# Altium project MicroDial_Data_Log_V2.PrjPCB
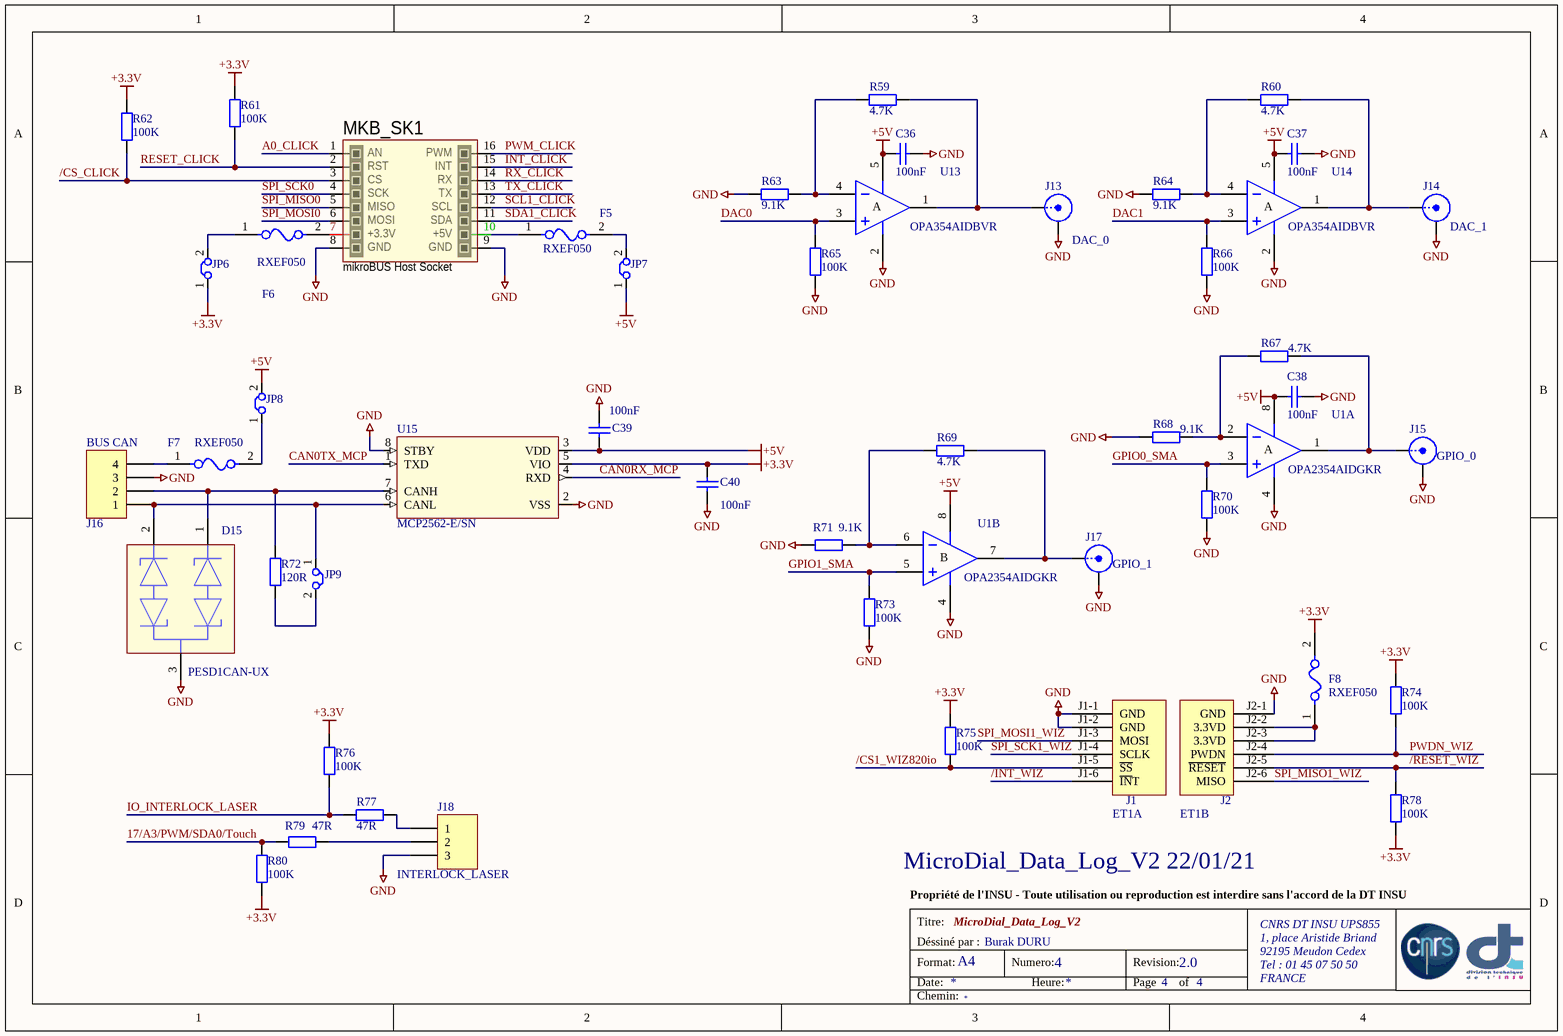
[diagram p0: MicroDial_Data_Log_V2_Part4.SchDoc]
4 sheets, 207 parts. Net scope: global (net labels, ports and power ports of the same name join across sheets).
Board file: MicroDial_Data_Log_V2.PcbDoc
Sheets:
  MicroDial_Data_Log_V2_Part4.SchDoc
  MicroDial_Data_Log_V2_Part2.SchDoc
  MicroDial_Data_Log_V2_Part3.SchDoc
  MicroDial_Data_Log_V2.SchDoc

## Sheet MicroDial_Data_Log_V2_Part4.SchDoc: MicroDial_Data_Log_V2
size A4; Author: Burak DURU; Organization: CNRS DT INSU UPS855; Address1: 1, place Aristide Briand; Address2: 92195 Meudon Cedex; Address3: Tel : 01 45 07 50 50; Address4: FRANCE; DocumentNumber: 4; Revision: 2.0; SheetNumber: 4; SheetTotal: 4

### Parts
C36  value 100nF  [C603]  (hidden comment: Capacitor CMS)
C37  value 100nF  [C603]  (hidden comment: Capacitor CMS)
C38  value 100nF  [C603]  (hidden comment: Capacitor CMS)
C39  value 100nF  [C603]  (hidden comment: Capacitor CMS)
C40  value 100nF  [C603]  (hidden comment: Capacitor CMS)
D15  PESD1CAN-UX  [SOT323 (SC70) - PESD1CAN-UX]
ET1  Module ETHERNET WIZNET WIZ820IO  [WIZ820io-V1.0]  (value not drawn)  (parts A,B of 2)
F5  RXEF050  [FP-RXEF050-MFG]
F6  RXEF050  [FP-RXEF050-MFG]
F7  RXEF050  [FP-RXEF050-MFG]
F8  RXEF050  [FP-RXEF050-MFG]
J13  DAC_0  [SMB125B1]
J14  DAC_1  [SMB125B1]
J15  GPIO_0  [SMA R125.680.000]
J16  BUS CAN  [PHOENIX CONTACT MC 1,5/ 4-G-3,81 - 1803293]
J17  GPIO_1  [SMA R125.680.000]
J18  INTERLOCK_LASER  [Molex 90136-2203 - UPDATE]
JP6  Cavalier 1 Positions 1-2  [Molex 90120-0762]  (value not drawn)
JP7  Cavalier 1 Positions 1-2  [Molex 90120-0762]  (value not drawn)
JP8  Cavalier 1 Positions 1-2  [Molex 90120-0762]  (value not drawn)
JP9  Cavalier 1 Positions 1-2  [Molex 90120-0762]  (value not drawn)
MKB_SK1  mikroBUS Host Socket  [mikroBUS Host Socket]
R59  value 4.7K  [MMA204]  (hidden comment: Res)
R60  value 4.7K  [MMA204]  (hidden comment: Res)
R61  value 100K  [R603]  (hidden comment: Res)
R62  value 100K  [R603]  (hidden comment: Res)
R63  value 9.1K  [MMA204]  (hidden comment: Res)
R64  value 9.1K  [MMA204]  (hidden comment: Res)
R65  value 100K  [R603]  (hidden comment: Res)
R66  value 100K  [R603]  (hidden comment: Res)
R67  value 4.7K  [MMA204]  (hidden comment: Res)
R68  value 9.1K  [MMA204]  (hidden comment: Res)
R69  value 4.7K  [MMA204]  (hidden comment: Res)
R70  value 100K  [R603]  (hidden comment: Res)
R71  value 9.1K  [MMA204]  (hidden comment: Res)
R72  value 120R  [R603]  (hidden comment: Res)
R73  value 100K  [R603]  (hidden comment: Res)
R74  value 100K  [R603]  (hidden comment: Res)
R75  value 100K  [R603]  (hidden comment: Res)
R76  value 100K  [R603]  (hidden comment: Res)
R77  value 47R  [R603]  (hidden comment: Res)
R78  value 100K  [R603]  (hidden comment: Res)
R79  value 47R  [R603]  (hidden comment: Res)
R80  value 100K  [R603]  (hidden comment: Res)
U1  OPA2354AIDGKR  [VSSOP-8 (DGK(S-PDSO-G8))]  (parts A,B of 2)
U13  OPA354AIDBVR  [SOT23-5]
U14  OPA354AIDBVR  [SOT23-5]
U15  MCP2562-E/SN  [SOIC8N (Narrow) - MCP2562-E]

### Nets
+3.3V: C40.1 F8.2 JP6.1 R61.2 R62.2 R74.2 R75.2 R76.2 R78.2 R80.1 U15.5(VIO)
+5V: C36.1 C37.1 C38.1 C39.1 JP7.1 JP8.2 U1.8(V+) U13.5(V+) U14.5(V+) U15.3(VDD)
GND: C36.2 C37.2 C38.2 C39.2 C40.2 D15.3(common_cathode) ET1.J1-1(GND) ET1.J1-2(GND) ET1.J2-1(GND) J13.2(Y) J14.2(Y) J15.2(Y) J16.3 J17.2(Y) J18.3 MKB_SK1.8(GND) MKB_SK1.9(GND) R63.1 R64.1 R65.1 R66.1 R68.1 R70.1 R71.1 R73.1 U1.4(V-) U13.2(V-) U14.2(V-) U15.2(VSS) U15.8(STBY)  [project net DIP2_1]
17/A3/PWM/SDA0/Touch: R79.1 R80.2
/CS1_WIZ820io: ET1.J1-5(~{SS}) R75.1
/CS_CLICK: MKB_SK1.3(CS) R62.1
/INT_WIZ: ET1.J1-6(~{IN}T)
/RESET_WIZ: ET1.J2-5(~{RESET}) R78.1
A0_CLICK: MKB_SK1.1(AN)
CAN0RX_MCP: U15.4(RXD)
CAN0TX_MCP: U15.1(TXD)
DAC0: R65.2 U13.3(IN+)
DAC1: R66.2 U14.3(IN+)
GPIO0_SMA: R70.2 U1.3(IN+)
GPIO1_SMA: R73.2 U1.5(IN+)
INT_CLICK: MKB_SK1.15(INT)
IO_INTERLOCK_LASER: R76.1 R77.1
PWDN_WIZ: ET1.J2-4(PWDN) R74.1
PWM_CLICK: MKB_SK1.16(PWM)
RESET_CLICK: MKB_SK1.2(RST) R61.1
RX_CLICK: MKB_SK1.14(RX)
SCL1_CLICK: MKB_SK1.12(SCL)
SDA1_CLICK: MKB_SK1.11(SDA)
SPI_MISO0: MKB_SK1.5(MISO)
SPI_MISO1_WIZ: ET1.J2-6(MISO)
SPI_MOSI0: MKB_SK1.6(MOSI)
SPI_MOSI1_WIZ: ET1.J1-3(MOSI)
SPI_SCK0: MKB_SK1.4(SCK)
SPI_SCK1_WIZ: ET1.J1-4(SCLK)
TX_CLICK: MKB_SK1.13(TX)
NetD15_1: D15.1(cathode_1) J16.2 R72.2 U15.7(CANH)
NetD15_2: D15.2(cathode_2) J16.1 JP9.1 U15.6(CANL)
NetET1_J2-2: ET1.J2-2(3.3VD) ET1.J2-3(3.3VD) F8.1
NetF5_1: F5.1 MKB_SK1.10(+5V)
NetF5_2: F5.2 JP7.2
NetF6_1: F6.1 JP6.2
NetF6_2: F6.2 MKB_SK1.7(+3.3V)
NetF7_1: F7.1 J16.4
NetF7_2: F7.2 JP8.1
NetJ13_1: J13.1(X) R59.2 U13.1(OUT)
NetJ14_1: J14.1(X) R60.2 U14.1(OUT)
NetJ15_1: J15.1(X) R67.2 U1.1(OUT)
NetJ17_1: J17.1(X) R69.2 U1.7(OUT)
NetJ18_1: J18.1 R77.2
NetJ18_2: J18.2 R79.2
NetJP9_2: JP9.2 R72.1
NetR59_1: R59.1 R63.2 U13.4(IN-)
NetR60_1: R60.1 R64.2 U14.4(IN-)
NetR67_1: R67.1 R68.2 U1.2(IN-)
NetR69_1: R69.1 R71.2 U1.6(IN-)

Not connected (* = marked no-connect by the designer): J13 3(REF) 4(REF) 5(REF); J14 3(REF) 4(REF) 5(REF); J15 3(REF) 4(REF) 5(REF); J17 3(REF) 4(REF) 5(REF)

### Notes on the sheet
- MicroDial_Data_Log_V2 22/01/21
- Propriété de l'INSU - Toute utilisation ou reproduction est interdire sans l'accord de la DT INSU
- Titre:
- Format:
- Date:
- Déssiné par :
- A4
- Numero:
- Heure:
- Revision:
- Page
- of
- Chemin:
- (in symbol OPA354AIDBVR) A
- (in symbol OPA2354AIDGKR, part A) A
- (in symbol OPA2354AIDGKR, part B) B
- (in symbol WIZ820IO, part A) J1
- (in symbol WIZ820IO, part B) J2

### Library data of the parts
C36-C40 = Cap: 06035C104JAT2A - Condensateur céramique multicouche CMS, 0603 [1608 Metric], 0.1 µF, 50 V, ± 5%, X7R; Code Commande: F174-0621
D15 = PESD1CAN-UX: Circuit de protection ESD, 50 V, SOT-323, 3 Broche(s), 150 W, PESD1 Series; Code Commande: F2357118; Value: PESD1CAN-UX
ET1 = WIZ820IO: IC MODULE W5200+MAG JACK Ethernet Contrôleur 10/100 Base-T/TX PHY SPI Interface Module WIZ820IO; Code Commande: Mouser 950-WIZ820IO + Digi-key  1278-1015-ND; Value: WIZNET WIZ820io
F5-F8 = RXEF050: RXEF050 -  Fusible PPTC réarmable, broches radiales, Série PolySwitch RXEF, 72 VDC, 500 mA, 1 A, 4 s, Rond; Code Commande: F117-5864; ComponentLink2Description: Datasheet; ComponentLink2URL: https://www.littelfuse.com/~/media/electronics/datasheets/resettable_ptcs/littelfuse_ptc_radial_leaded_rxef_datasheet.pdf.pdf; Value: RXEF050
J13 J14 = SMB1252B1-3GT30-50: Code Commande: F365-1241; Value: SMB1252B1-3GT30-50
J15 J17 = SMA RADIALL - R125680000: RADIALL - R125680000; Code Commande: F419-4810; Value: RADIALL - R125680000
J16 = PHOENIX CONTACT MC 1,5/ 4-G-3,81 - 1803293: Code Commande: F370-4749 / Digi-Key 277-1208-ND; Value: PHOENIX CONTACT MC 1,5/ 4-G-3,81 - 1803293
J18 = Molex 90136-2203: Molex 90136-2203 CGRID3 Simple Rangée Coudé 3V; Code Commande: RS670-5385; Value: Molex 90136-2203
JP6-JP9 = Jump 12: Jumper 2 Wire; Value: Molex 90120-0762; Code Commande: F973-3302
MKB_SK1 = mikroBUS Host Socket: mikroBUS Host Socket (Receptacle carte CLICK)
R59 R60 R67 R69 = Res: MMA02040E4701BB100 - Résistance CMS MELF, 4.7 kohm, Série MMA 0204, 200 V, Couche métallique, 250 mW, ± 0.1%; Code Commande: F308-6100
R61 R62 R65 R66 R70 R73-R76 R78 R80 = Res: CRGP0603F100K - Résistance à puce CMS, 100 kohm, ± 1%, 250 mW, 0603 [1608 Metric], Couche épaisse /; Code Commande: F286-1058
R63 R64 R68 R71 = Res: MMA02040E9101BB100 - Résistance CMS MELF, 9.1 kohm, Série MMA 0204, 200 V, Couche métallique, 250 mW, ± 0.1%; Code Commande: F308-6173
R72 = Res: CRGP0603F100K - Résistance à puce CMS, 100 kohm, ± 1%, 250 mW, 0603 [1608 Metric], Couche épaisse /; Code Commande: F348-2541
R77 R79 = Res: ERJ-UP3J470V - RES, 47R, 5%, 0.25W, 0603, THICK FILM; Code Commande: F348-2241
U1 = OPA2354AIDGKR: OPA2354AIDGKR Amplificateur opérationnel, Double, 2 amplificateurs, 350 kHz, 0.16 V/µs, 1.8V à 5.5V; Code Commande: F311-7463; Value: OPA2354AIDGKR
U13 U14 = OPA354AIDBVR: Amplificateur opérationnel, 1 amplificateur, 250 MHz, 150 V/µs, 2.5V à 5.5V, ± 1.25V à ± 2.75V; Code Commande: F311-7557 /Digikey 296-26279-1-ND; Value: OPA354AIDBVR
U15 = MCP2562-E/SN: MCP2562-E/SN Bus CAN, Émetteur-récepteur, CAN, LIN, 1, 1, 4.5 V, 5.5 V, SOIC; Code Commande: F236-2839; Value: MCP2562-E/SN

## Sheet MicroDial_Data_Log_V2_Part2.SchDoc: MicroDial_Data_Log_V2
size A4; Author: Burak DURU; Organization: CNRS DT INSU UPS855; Address1: 1, place Aristide Briand; Address2: 92195 Meudon Cedex; Address3: Tel : 01 45 07 50 50; Address4: FRANCE; DocumentNumber: 2; Revision: 2.0; SheetNumber: 2; SheetTotal: 4
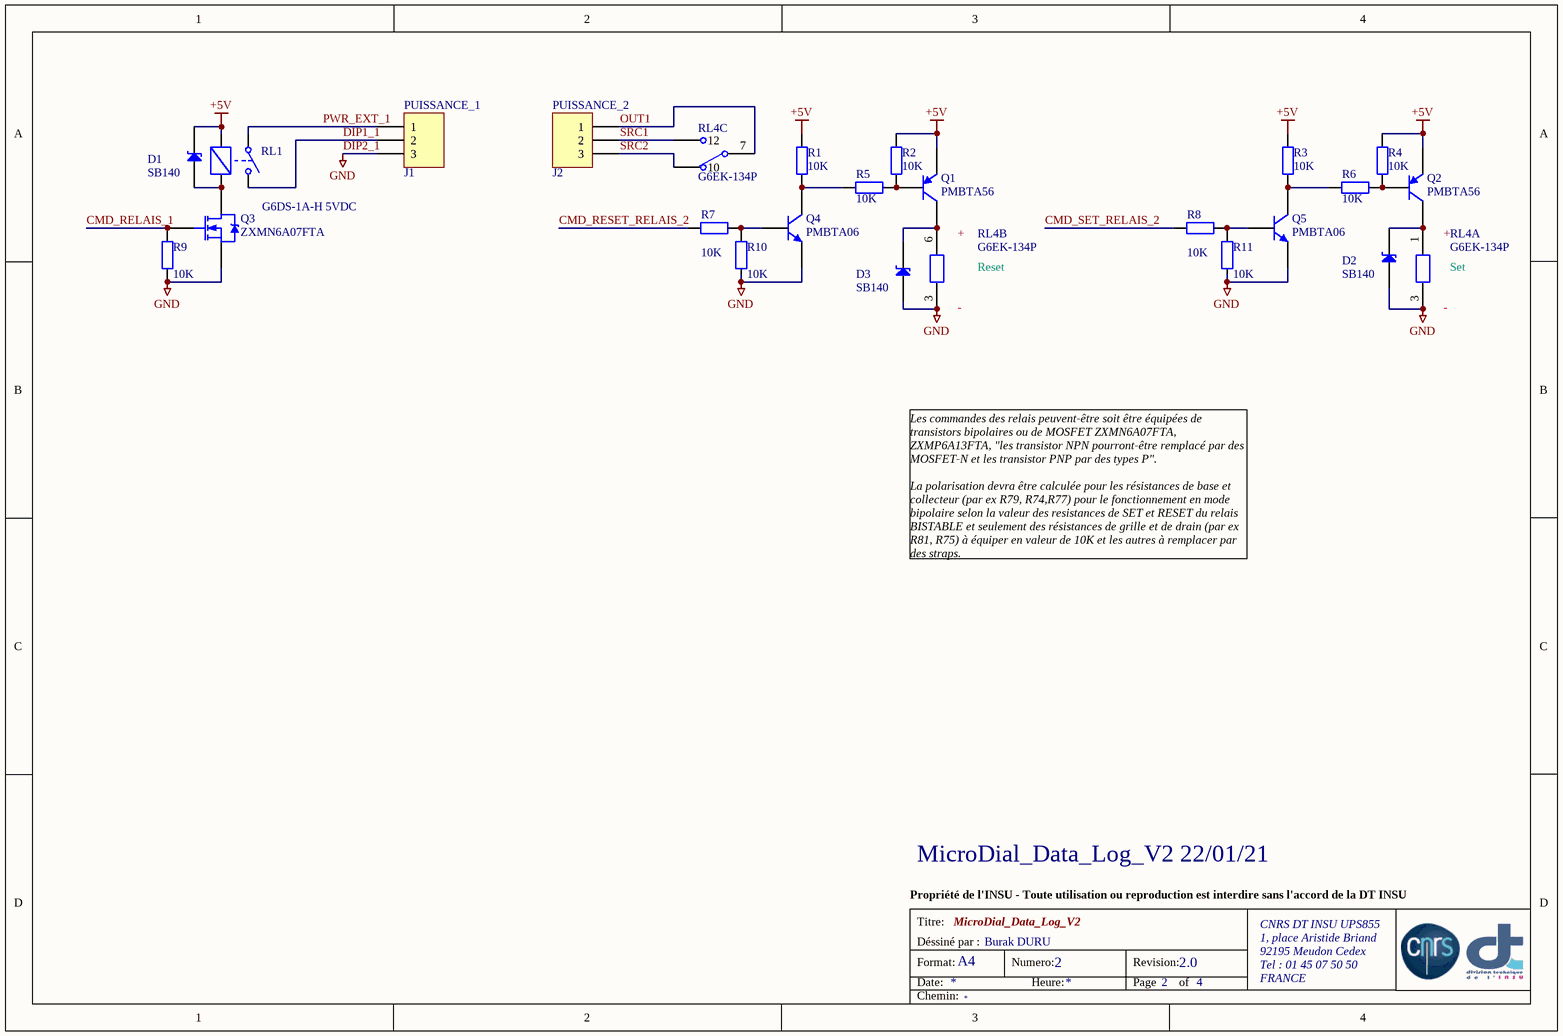
[diagram p1: MicroDial_Data_Log_V2_Part2.SchDoc]

### Parts
D1  SB140  [DO-41]
D2  SB140  [DO-41]
D3  SB140  [DO-41]
J1  PUISSANCE_1  [MKDS 1/3-3.81]
J2  PUISSANCE_2  [MKDS 1/3-3.81]
Q1  PMBTA56  [SOT-23A]
Q2  PMBTA56  [SOT-23A]
Q3  ZXMN6A07FTA  [SOT23 - NMOSFET]
Q4  PMBTA06  [SOT-23A]
Q5  PMBTA06  [SOT-23A]
R1  value 10K  [R603]  (hidden comment: Res)
R2  value 10K  [R603]  (hidden comment: Res)
R3  value 10K  [R603]  (hidden comment: Res)
R4  value 10K  [R603]  (hidden comment: Res)
R5  value 10K  [R603]  (hidden comment: Res)
R6  value 10K  [R603]  (hidden comment: Res)
R7  value 10K  [R603]  (hidden comment: Res)
R8  value 10K  [R603]  (hidden comment: Res)
R9  value 10K  [R603]  (hidden comment: Res)
R10  value 10K  [R603]  (hidden comment: Res)
R11  value 10K  [R603]  (hidden comment: Res)
RL1  G6DS-1A-H 5VDC  [G6DS-1A-H]
RL4  G6EK-134P  [G6EK-134P]  (parts A,B,C of 3)

### Nets
+5V: D1.2(K) Q1.2(E) Q2.2(E) R1.1 R2.1 R3.1 R4.1 RL1.16
DIP2_1: D2.1(A) D3.1(A) J1.3 Q3.3(S) Q4.2(E) Q5.2(E) R9.1 R10.1 R11.1 RL4.3  [also labelled GND]
CMD_RELAIS_1: Q3.1(G) R9.2
CMD_RESET_RELAIS_2: R7.2
CMD_SET_RELAIS_2: R8.2
DIP1_1: J1.2 RL1.6
OUT1: J2.1 RL4.7
PWR_EXT_1: J1.1 RL1.8
SRC1: J2.2 RL4.12
SRC2: J2.3 RL4.10
NetD1_1: D1.1(A) Q3.2(D) RL1.15
NetD2_2: D2.2(K) Q2.3(C) RL4.1
NetD3_2: D3.2(K) Q1.3(C) RL4.6
NetQ1_1: Q1.1(B) R2.2 R5.2
NetQ2_1: Q2.1(B) R4.2 R6.2
NetQ4_1: Q4.1(B) R7.1 R10.2
NetQ4_3: Q4.3(C) R1.2 R5.1
NetQ5_1: Q5.1(B) R8.1 R11.2
NetQ5_3: Q5.3(C) R3.2 R6.1

### Notes on the sheet
- Les commandes des relais peuvent-être soit être équipées de transistors bipolaires ou de MOSFET ZXMN6A07FTA, ZXMP6A13FTA, "les transistor NPN pourront-être remplacé par des MOSFET-N et les transistor PNP par des types P".
  La polarisation devra être calculée pour les résistances de base et collecteur (par ex R79, R74,R77) pour le fonctionnement en mode bipolaire selon la valeur des resistances de SET et RESET du relais BISTABLE et seulement des résistances de grille et de drain (par ex R81, R75) à équiper en valeur de 10K et les autres à remplacer par des straps.
- MicroDial_Data_Log_V2 22/01/21
- Propriété de l'INSU - Toute utilisation ou reproduction est interdire sans l'accord de la DT INSU
- Titre:
- Format:
- Date:
- Déssiné par :
- A4
- Numero:
- Heure:
- Revision:
- Page
- of
- Chemin:
- (in symbol G6EK-134P, part A) +; Set; -
- (in symbol G6EK-134P, part B) +; Reset; -

### Library data of the parts
D1-D3 = Diode_Schottky: SB140  Redresseur Schottky, 40 V, 1 A, Une, DO-41 (DO-204AL), 2 Broche(s), 500 mV; Code Commande: F146-7528; Value: SB140
J1 J2 = PHOENIX CONTACT MKDS 1/3-3.81: PHOENIX CONTACT MKDS 1/3-3.81  SR 3V DROIT; Value: PHOENIX CONTACT MKDS 1/ 3-3,81 - 1727023; Code Commande: F370-4580
Q1 Q2 = PMBTA56: PNP General Purpose Amplifier; Code Commande: Mouser 771-PMBTA56-T/R; Value: PMBTA56
Q3 = ZXMN6A07FTA: 60V N-Channel ENHANCEMENT MODE MOSFET; Code Commande: Mouser 522-ZXMN6A07FTA ou F952-5769; Value: ZXMN6A07FTA
Q4 Q5 = PMBTA06: NPN General Purpose Amplifier; Code Commande: MOUSER 771-PMBTA06-T/R; Value: PMBTA06
R1-R11 = Res: WF06P1002FTL Résistance à puce CMS, 10 kohm, ± 1%, 125 mW, 0603 [1608 Metric], Couche épaisse, Haute puissance; Code Commande: F250-2802
RL1 = G6DS-1A-H 5VDC: Relais 1RT Normalement Ouvert 5V 5A; Code Commande: RS613-2305; Value: G6D-1A-ASI 5VDC
RL4 = G6EK-134P: SPST RELAIS DOUBLE COIL; Value: G6EK-134P-ST-US-DC5; Code Commande: Mouser 653-G6EK-134P-DC5 / RS 683-9469

## Sheet MicroDial_Data_Log_V2_Part3.SchDoc: MicroDial_Data_Log_V2
size A4; Author: Burak DURU; Organization: CNRS DT INSU UPS855; Address1: 1, place Aristide Briand; Address2: 92195 Meudon Cedex; Address3: Tel : 01 45 07 50 50; Address4: FRANCE; DocumentNumber: 3; Revision: 2.0; SheetNumber: 3; SheetTotal: 4
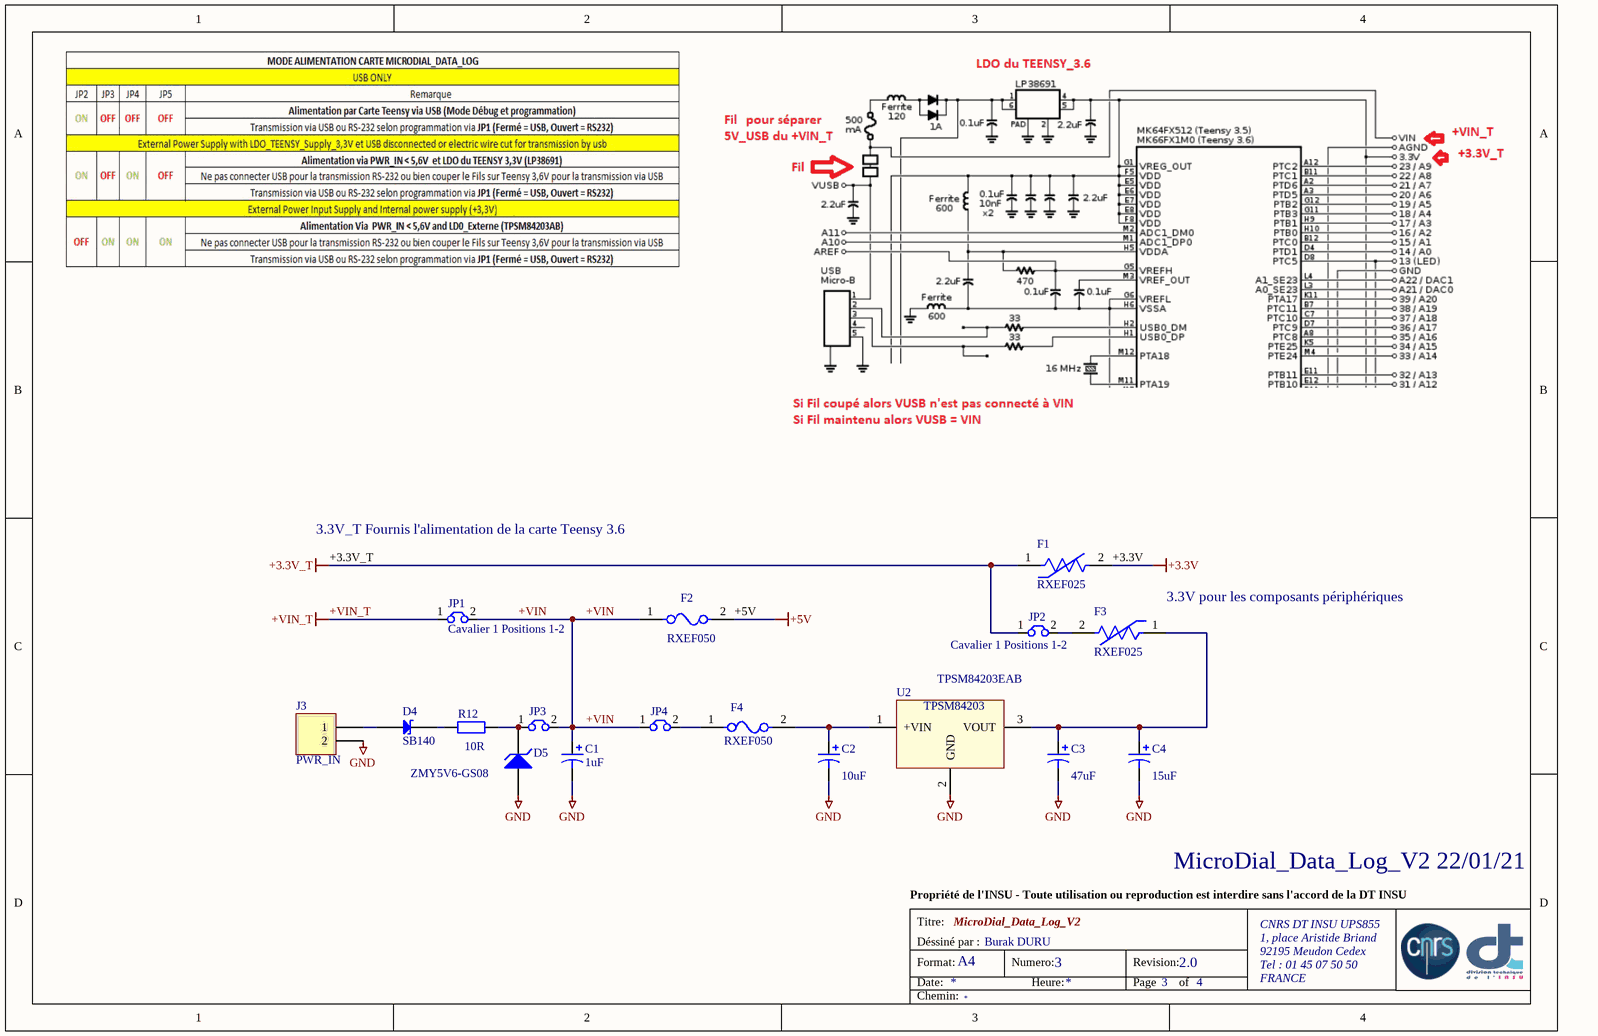
[diagram p2: MicroDial_Data_Log_V2_Part3.SchDoc]

### Parts
C1  value 1uF  [CAPPR5-10*x11.5]  (hidden comment: Condensateur Nichicon, 1μF, 450V c.c., série PS)
C2  value 10uF  [CAPA-B]  (hidden comment: Polarized Capacitor Tantale)
C3  value 47uF  [CAPA-B]  (hidden comment: Polarized Capacitor Tantale)
C4  value 15uF  [CAPA-D]  (hidden comment: Polarized Capacitor Tantale)
D4  SB140  [DO-41]
D5  ZMY5V6-GS08  [MELF DO-213AB]
F1  RXEF025  [FP-RXEF025-MFG]
F2  RXEF050  [FP-RXEF050-MFG]
F3  RXEF025  [FP-RXEF025-MFG]
F4  RXEF050  [FP-RXEF050-MFG]
J3  PWR_IN  [SL 3.5/2/90G]
JP1  Cavalier 1 Positions 1-2  [Molex 90120-0762]
JP2  Cavalier 1 Positions 1-2  [Molex 90120-0762]
JP3  Cavalier 1 Positions 1-2  [Molex 90120-0762]  (value not drawn)
JP4  Cavalier 1 Positions 1-2  [Molex 90120-0762]  (value not drawn)
R12  value 10R  [R1206]  (hidden comment: Res)
U2  TPSM84203EAB  [TPSM842XX SIPMODULE]

### Nets
+3.3V: F1.2
+3.3V_T: F1.1 JP2.1
+5V: F2.2
+VIN_T: JP1.1
GND: C1.2 C2.2 C3.2 C4.2 D5.1(A) J3.2 U2.2(GND)  [project net DIP2_1]
+VIN: C1.1 F2.1 JP1.2 JP3.2 JP4.1
NetC2_1: C2.1 F4.2 U2.1(+VIN)
NetC3_1: C3.1 C4.1 F3.1 U2.3(VOUT)
NetD4_1: D4.1(A) J3.1
NetD4_2: D4.2(K) R12.1
NetD5_2: D5.2(K) JP3.1 R12.2
NetF3_2: F3.2 JP2.2
NetF4_1: F4.1 JP4.2

### Notes on the sheet
- 3.3V_T Fournis l'alimentation de la carte Teensy 3.6
- (near F3) 3.3V pour les composants périphériques
- MicroDial_Data_Log_V2 22/01/21
- Propriété de l'INSU - Toute utilisation ou reproduction est interdire sans l'accord de la DT INSU
- Titre:
- Format:
- Date:
- Déssiné par :
- A4
- Numero:
- Heure:
- Revision:
- Page
- of
- Chemin:
- (in symbol TPSM84203EAB) TPSM84203

### Library data of the parts
C1 = Cap  Aluminuim Pol: Code Commande: RS851-5339
C2 = Cap Tantale Pol: 293D106X9025B2TE3 -  Condensateur tantale CMS, TANTAMOUNT®, 10 µF, 25 V, 1411 [3528 Metric], Série 293D, ± 10%, -55 °C; Code Commande: F235-3056
C3 = Cap Tantale Pol: T491B476K010AT -  Condensateur tantale CMS, 47 µF, 10 V, 1411 [3528 Metric], Série T491, ± 10%, -55 °C; Code Commande: F145-7458
C4 = Cap Tantale Pol: T491D156K035AT / Condensateur tantale CMS, 15 µF, 35 V, 2917 [7343 Metric], Série T491, ± 10%, -55 °C; Code Commande: F145-7496
D4 = Diode_Schottky: SB140 Redresseur Schottky, 40 V, 1 A, Une, DO-41 (DO-204AL), 2 Broche(s), 500 mV; Code Commande: F146-7528; Value: SB140
D5 = ZMY5V6-GS08: ZMY5V6-GS08 Diode simple Zener, AEC-Q101, 5.6 V, 1 W, MELF, 2 Broche(s), 175 °C /; Code Commande: F161-7742; Value: ZMY5V6-GS08
F1 F3 = RXEF025: RXEF025 -  FUSE, PTC RESET, 72V, 250mA, RADIAL; Code Commande: F266-8022; ComponentLink2URL: https://www.littelfuse.com/~/media/electronics/datasheets/resettable_ptcs/littelfuse_ptc_radial_leaded_rxef_datasheet.pdf.pdf; ComponentLink2Description: Datasheet; Value: RXEF025
F2 F4 = RXEF050: as F5 on sheet MicroDial_Data_Log_V2_Part4; ComponentLink2Description: Datasheet; ComponentLink2URL: https://www.littelfuse.com/~/media/electronics/datasheets/resettable_ptcs/littelfuse_ptc_radial_leaded_rxef_datasheet.pdf.pdf; Value: RXEF050
J3 = WEIDMULLER SL 3.5/2/90G: WEIDMULLER SL 3.5/2/90B SR 2V COUDE; Code Commande: RS171-578; Value: WEIDMULLER SL 3.5/2/90G
JP1-JP4 = Jump 12: as JP6 on sheet MicroDial_Data_Log_V2_Part4
R12 = Res: CRM1206-FX-10R0ELF -  Résistance à puce CMS, 10 ohm, ± 1%, 500 mW, 1206 [3216 Metric], Couche épaisse, Haute puissance,± 100ppm/°C; Code Commande: F186-5248
U2 = TPSM84203EAB: TPSM84203EAB -  Convertisseur DC/DC, 1 sortie, 4.95 W, 3.3 V, 1.5 A, TPSM842xx Family; Code Commande: F300-9711 / Mouser 595-TPSM84203EAB; Value: TPSM84203EAB -  Convertisseur DC/DC, 1 sortie, 4.95 W, 3.3 V, 1.5 A, TPSM842xx Family

## Sheet MicroDial_Data_Log_V2.SchDoc: MicroDial_Data_Log_V2
size A3; Author: Burak DURU; Organization: DT INSU CNRS; Address1: 1, place Aristide Briand; Address2: 92195 Meudon Cedex; Address3: Tel: 01 45 07 50 50; Address4: FRANCE; DocumentNumber: 1; Revision: 2.0; SheetNumber: 1; SheetTotal: 4
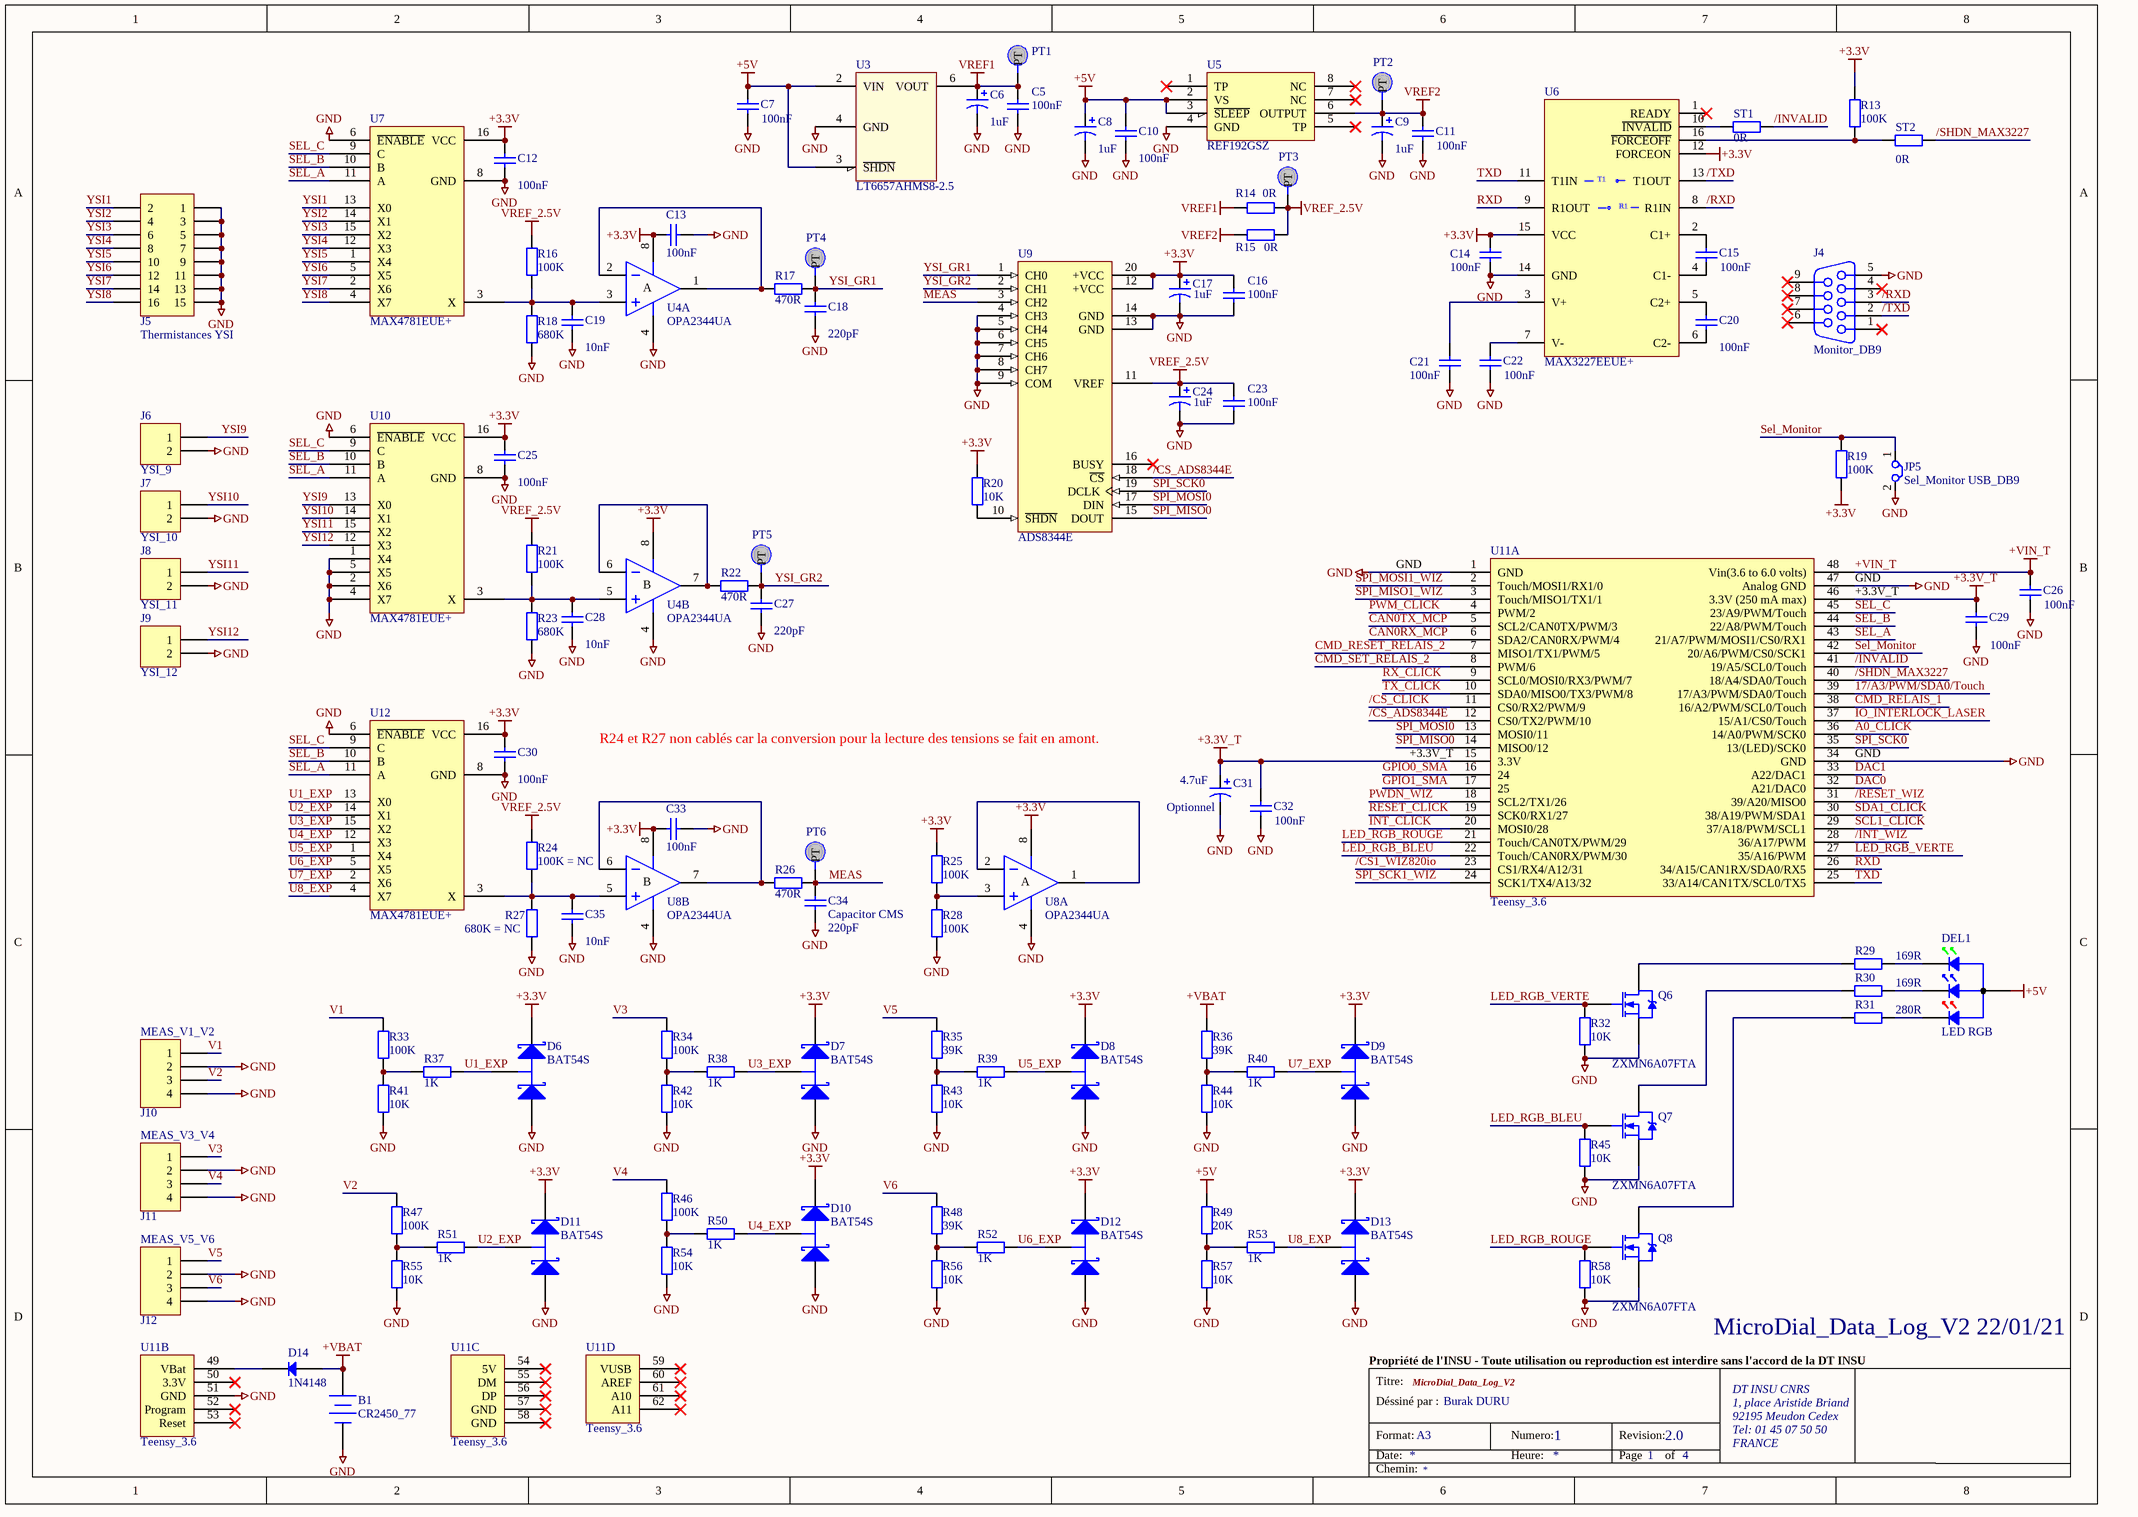
[diagram p3: MicroDial_Data_Log_V2.SchDoc]

### Parts
B1  CR2450_77  [Keystone-PN1025-7]
C5  value 100nF  [C603]  (hidden comment: Capacitor CMS)
C6  value 1uF  [CAPA-B]  (hidden comment: Polarized Capacitor Tantale)
C7  value 100nF  [C603]  (hidden comment: Capacitor CMS)
C8  value 1uF  [CAPA-B]  (hidden comment: Polarized Capacitor Tantale)
C9  value 1uF  [CAPA-B]  (hidden comment: Polarized Capacitor Tantale)
C10  value 100nF  [C603]  (hidden comment: Capacitor CMS)
C11  value 100nF  [C603]  (hidden comment: Capacitor CMS)
C12  value 100nF  [C603]  (hidden comment: Capacitor CMS)
C13  value 100nF  [C603]  (hidden comment: Capacitor CMS)
C14  value 100nF  [C603]  (hidden comment: Capacitor CMS)
C15  value 100nF  [C603]  (hidden comment: Capacitor CMS)
C16  value 100nF  [C603]  (hidden comment: Capacitor CMS)
C17  value 1uF  [CAPA-B]  (hidden comment: Polarized Capacitor Tantale)
C18  value 220pF  [C805]  (hidden comment: Capacitor CMS)
C19  value 10nF  [C603]  (hidden comment: Capacitor CMS)
C20  value 100nF  [C603]  (hidden comment: Capacitor CMS)
C21  value 100nF  [C603]  (hidden comment: Capacitor CMS)
C22  value 100nF  [C603]  (hidden comment: Capacitor CMS)
C23  value 100nF  [C603]  (hidden comment: Capacitor CMS)
C24  value 1uF  [CAPA-B]  (hidden comment: Polarized Capacitor Tantale)
C25  value 100nF  [C603]  (hidden comment: Capacitor CMS)
C26  value 100nF  [C603]  (hidden comment: Capacitor CMS)
C27  value 220pF  [C805]  (hidden comment: Capacitor CMS)
C28  value 10nF  [C603]  (hidden comment: Capacitor CMS)
C29  value 100nF  [C603]  (hidden comment: Capacitor CMS)
C30  value 100nF  [C603]  (hidden comment: Capacitor CMS)
C31  value 4.7uF  [CAPA-B]  (hidden comment: Polarized Capacitor Tantale)
C32  value 100nF  [C603]  (hidden comment: Capacitor CMS)
C33  value 100nF  [C603]  (hidden comment: Capacitor CMS)
C34  Capacitor CMS  value 220pF  [C805]
C35  value 10nF  [C603]  (hidden comment: Capacitor CMS)
D6  BAT54S  [SOT23 - SCHOTTKY]
D7  BAT54S  [SOT23 - SCHOTTKY]
D8  BAT54S  [SOT23 - SCHOTTKY]
D9  BAT54S  [SOT23 - SCHOTTKY]
D10  BAT54S  [SOT23 - SCHOTTKY]
D11  BAT54S  [SOT23 - SCHOTTKY]
D12  BAT54S  [SOT23 - SCHOTTKY]
D13  BAT54S  [SOT23 - SCHOTTKY]
D14  1N4148  [DO-35]
DEL1  LED RGB  [Kingbright WP154A4SEJ3VBDZGW/CA]
J4  Monitor_DB9  [CONEC 164A11519X]
J5  Thermistances YSI  [Molex 90130-3216]
J6  YSI_9  [Molex 90136-2202 - UPDATE]
J7  YSI_10  [Molex 90136-2202 - UPDATE]
J8  YSI_11  [Molex 90136-2202 - UPDATE]
J9  YSI_12  [Molex 90136-2202 - UPDATE]
J10  MEAS_V1_V2  [MKDS 1/4-3.81]
J11  MEAS_V3_V4  [MKDS 1/4-3.81]
J12  MEAS_V5_V6  [MKDS 1/4-3.81]
JP5  Sel_Monitor USB_DB9  [Molex 90120-0762]
PT1  Point Test  [PT]  (value not drawn)
PT2  Point Test  [PT]  (value not drawn)
PT3  Point Test  [PT]  (value not drawn)
PT4  Point Test  [PT]  (value not drawn)
PT5  Point Test  [PT]  (value not drawn)
PT6  Point Test  [PT]  (value not drawn)
Q6  ZXMN6A07FTA  [SOT23 - NMOSFET]
Q7  ZXMN6A07FTA  [SOT23 - NMOSFET]
Q8  ZXMN6A07FTA  [SOT23 - NMOSFET]
R13  value 100K  [R603]  (hidden comment: Res)
R14  value 0R  [R603]  (hidden comment: Res)
R15  value 0R  [R603]  (hidden comment: Res)
R16  value 100K  [MMA204]  (hidden comment: Res)
R17  value 470R  [R603]  (hidden comment: Res)
R18  value 680K  [MMA204]  (hidden comment: Res)
R19  value 100K  [R603]  (hidden comment: Res)
R20  value 10K  [R603]  (hidden comment: Res)
R21  value 100K  [MMA204]  (hidden comment: Res)
R22  value 470R  [R603]  (hidden comment: Res)
R23  value 680K  [MMA204]  (hidden comment: Res)
R24  value 100K = NC  [MMA204]  (hidden comment: Res)
R25  value 100K  [R603]  (hidden comment: Res)
R26  value 470R  [R603]  (hidden comment: Res)
R27  value 680K = NC  [MMA204]  (hidden comment: Res)
R28  value 100K  [R603]  (hidden comment: Res)
R29  value 169R  [R603]  (hidden comment: Res)
R30  value 169R  [R603]  (hidden comment: Res)
R31  value 280R  [R603]  (hidden comment: Res)
R32  value 10K  [R603]  (hidden comment: Res)
R33  value 100K  [MMA204]  (hidden comment: Res)
R34  value 100K  [MMA204]  (hidden comment: Res)
R35  value 39K  [MMA204]  (hidden comment: Res)
R36  value 39K  [MMA204]  (hidden comment: Res)
R37  value 1K  [R603]  (hidden comment: Res)
R38  value 1K  [R603]  (hidden comment: Res)
R39  value 1K  [R603]  (hidden comment: Res)
R40  value 1K  [R603]  (hidden comment: Res)
R41  value 10K  [MMA204]  (hidden comment: Res)
R42  value 10K  [MMA204]  (hidden comment: Res)
R43  value 10K  [MMA204]  (hidden comment: Res)
R44  value 10K  [MMA204]  (hidden comment: Res)
R45  value 10K  [R603]  (hidden comment: Res)
R46  value 100K  [MMA204]  (hidden comment: Res)
R47  value 100K  [MMA204]  (hidden comment: Res)
R48  value 39K  [MMA204]  (hidden comment: Res)
R49  value 20K  [MMA204]  (hidden comment: Res)
R50  value 1K  [R603]  (hidden comment: Res)
R51  value 1K  [R603]  (hidden comment: Res)
R52  value 1K  [R603]  (hidden comment: Res)
R53  value 1K  [R603]  (hidden comment: Res)
R54  value 10K  [MMA204]  (hidden comment: Res)
R55  value 10K  [MMA204]  (hidden comment: Res)
R56  value 10K  [MMA204]  (hidden comment: Res)
R57  value 10K  [MMA204]  (hidden comment: Res)
R58  value 10K  [R603]  (hidden comment: Res)
ST1  value 0R  [R603]  (hidden comment: Res)
ST2  value 0R  [R603]  (hidden comment: Res)
U3  LT6657AHMS8-2.5  [MSOP-8]
U4  OPA2344UA  [SOIC8N]  (parts A,B of 2)
U5  REF192GSZ  [SOIC8N]
U6  MAX3227EEUE+  [TSSOP-16 (U16-2)]
U7  MAX4781EUE+  [TSSOP-16]
U8  OPA2344UA  [SOIC8N]  (parts A,B of 2)
U9  ADS8344E  [QSOP20]
U10  MAX4781EUE+  [TSSOP-16]
U11  Teensy_3.6  [Teensy3_6]  (parts A,B,C,D of 4)
U12  MAX4781EUE+  [TSSOP-16]

### Nets
+3.3V: C12.1 C13.1 C14.1 C16.1 C17.1 C25.1 C30.1 C33.1 D6.2(K) D7.2(K) D8.2(K) D9.2(K) D10.2(K) D11.2(K) D12.2(K) D13.2(K) R13.1 R19.1 R20.2 R25.2 U4.8(V+) U6.12(FORCEON) U6.15(VCC) U7.16(VCC) U8.8(V+) U9.12(+VCC) U9.20(+VCC) U10.16(VCC) U12.16(VCC)
+3.3V_T: C29.1 C31.1 C32.1 U11.15(3.3V) U11.46(3.3V_(250_mA_max))
+5V: C7.1 C8.1 C10.1 DEL1.2(A_RGB) R49.2 U3.2(VIN) U3.3(~{SHDN}) U5.2(VS) U5.3(~{SLEEP})
+VBAT: B1.1(+) D14.1(A) R36.2
+VIN_T: C26.1 U11.48(Vin(3.6_to_6.0_volts))
GND: B1.2(-) C5.2 C6.2 C7.2 C8.2 C9.2 C10.2 C11.2 C12.2 C13.2 C14.2 C16.2 C17.2 C18.2 C19.2 C21.2 C22.2 C23.2 C24.2 C25.2 C26.2 C27.2 C28.2 C29.2 C30.2 C31.2 C32.2 C33.2 C34.2 C35.2 D6.3(A) D7.3(A) D8.3(A) D9.3(A) D10.3(A) D11.3(A) D12.3(A) D13.3(A) J4.5 J5.1 J5.3 J5.5 J5.7 J5.9 J5.11 J5.13 J5.15 J6.2 J7.2 J8.2 J9.2 J10.2 J10.4 J11.2 J11.4 J12.2 J12.4 JP5.2 Q6.3(S) Q7.3(S) Q8.3(S) R18.1 R23.1 R27.1 R28.1 R32.1 R41.1 R42.1 R43.1 R44.1 R45.1 R54.2 R55.1 R56.1 R57.1 R58.1 U3.4(GND) U4.4(V-) U5.4(GND) U6.14(GND) U7.6(~{ENABLE}) U7.8(GND) U8.4(V-) U9.4(CH3) U9.5(CH4) U9.6(CH5) U9.7(CH6) U9.8(CH7) U9.9(COM) U9.13(GND) U9.14(GND) U10.1(X4) U10.2(X6) U10.4(X7) U10.5(X5) U10.6(~{ENABLE}) U10.8(GND) U11.1(GND) U11.34(GND) U11.47(Analog_GND) U11.51(GND) U12.6(~{ENABLE}) U12.8(GND)  [project net DIP2_1]
VREF1: C5.1 C6.1 PT1.1(PT) R14.1 U3.6(VOUT)
VREF2: C9.1 C11.1 PT2.1(PT) R15.1 U5.6(OUTPUT)
VREF_2.5V: C23.1 C24.1 PT3.1(PT) R14.2 R15.2 R16.2 R21.2 R24.2 U9.11(VREF)
17/A3/PWM/SDA0/Touch: U11.39(17/A3/PWM/SDA0/Touch)
/CS1_WIZ820io: U11.23(CS1/RX4/A12/31)
/CS_ADS8344E: U9.18(~{CS}) U11.12(CS0/TX2/PWM/10)
/CS_CLICK: U11.11(CS0/RX2/PWM/9)
/INT_WIZ: U11.28(36/A17/PWM)
/INVALID: ST1.1 U11.41(19/A5/SCL0/Touch)
/RESET_WIZ: U11.31(39/A20/MISO0)
/RXD: J4.3 U6.8(R1IN)
/SHDN_MAX3227: ST2.2 U11.40(18/A4/SDA0/Touch)
/TXD: J4.2 U6.13(T1OUT)
A0_CLICK: U11.36(14/A0/PWM/SCK0)
CAN0RX_MCP: U11.6(SDA2/CAN0RX/PWM/4)
CAN0TX_MCP: U11.5(SCL2/CAN0TX/PWM/3)
CMD_RELAIS_1: U11.38(16/A2/PWM/SCL0/Touch)
CMD_RESET_RELAIS_2: U11.7(MISO1/TX1/PWM/5)
CMD_SET_RELAIS_2: U11.8(PWM/6)
DAC0: U11.32(A21/DAC0)
DAC1: U11.33(A22/DAC1)
GPIO0_SMA: U11.16(24)
GPIO1_SMA: U11.17(25)
INT_CLICK: U11.20(MOSI0/28)
IO_INTERLOCK_LASER: U11.37(15/A1/CS0/Touch)
LED_RGB_BLEU: Q7.1(G) R45.2 U11.22(Touch/CAN0RX/PWM/30)
LED_RGB_ROUGE: Q8.1(G) R58.2 U11.21(Touch/CAN0TX/PWM/29)
LED_RGB_VERTE: Q6.1(G) R32.2 U11.27(35/A16/PWM)
MEAS: C34.1 PT6.1(PT) R26.1 U9.3(CH2)
PWDN_WIZ: U11.18(SCL2/TX1/26)
PWM_CLICK: U11.4(PWM/2)
RESET_CLICK: U11.19(SCK0/RX1/27)
RX_CLICK: U11.9(SCL0/MOSI0/RX3/PWM/7)
RXD: U6.9(R1OUT) U11.26(34/A15/CAN1RX/SDA0/RX5)
SCL1_CLICK: U11.29(37/A18/PWM/SCL1)
SDA1_CLICK: U11.30(38/A19/PWM/SDA1)
SEL_A: U7.11(A) U10.11(A) U11.43(21/A7/PWM/MOSI1/CS0/RX1) U12.11(A)
SEL_B: U7.10(B) U10.10(B) U11.44(22/A8/PWM/Touch) U12.10(B)
SEL_C: U7.9(C) U10.9(C) U11.45(23/A9/PWM/Touch) U12.9(C)
Sel_Monitor: JP5.1 R19.2 U11.42(20/A6/PWM/CS0/SCK1)
SPI_MISO0: U9.15(DOUT) U11.14(MISO0/12)
SPI_MISO1_WIZ: U11.3(Touch/MISO1/TX1/1)
SPI_MOSI0: U9.17(DIN) U11.13(MOSI0/11)
SPI_MOSI1_WIZ: U11.2(Touch/MOSI1/RX1/0)
SPI_SCK0: U9.19(DCLK) U11.35(13/(LED)/SCK0)
SPI_SCK1_WIZ: U11.24(SCK1/TX4/A13/32)
TX_CLICK: U11.10(SDA0/MISO0/TX3/PWM/8)
TXD: U6.11(T1IN) U11.25(33/A14/CAN1TX/SCL0/TX5)
U1_EXP: D6.1(C) R37.1 U12.13(X0)
U2_EXP: D11.1(C) R51.1 U12.14(X1)
U3_EXP: D7.1(C) R38.1 U12.15(X2)
U4_EXP: D10.1(C) R50.2 U12.12(X3)
U5_EXP: D8.1(C) R39.1 U12.1(X4)
U6_EXP: D12.1(C) R52.1 U12.5(X5)
U7_EXP: D9.1(C) R40.1 U12.2(X6)
U8_EXP: D13.1(C) R53.1 U12.4(X7)
V1: J10.1 R33.2
V2: J10.3 R47.2
V3: J11.1 R34.2
V4: J11.3 R46.2
V5: J12.1 R35.2
V6: J12.3 R48.2
YSI1: J5.2 U7.13(X0)
YSI2: J5.4 U7.14(X1)
YSI3: J5.6 U7.15(X2)
YSI4: J5.8 U7.12(X3)
YSI5: J5.10 U7.1(X4)
YSI6: J5.12 U7.5(X5)
YSI7: J5.14 U7.2(X6)
YSI8: J5.16 U7.4(X7)
YSI9: J6.1 U10.13(X0)
YSI10: J7.1 U10.14(X1)
YSI11: J8.1 U10.15(X2)
YSI12: J9.1 U10.12(X3)
YSI_GR1: C18.1 PT4.1(PT) R17.1 U9.1(CH0)
YSI_GR2: C27.1 PT5.1(PT) R22.1 U9.2(CH1)
NetC15_1: C15.1 U6.2(C1+)
NetC15_2: C15.2 U6.4(C1-)
NetC19_1: C19.1 R16.1 R18.2 U4.3(IN+) U7.3(X)
NetC20_1: C20.1 U6.5(C2+)
NetC20_2: C20.2 U6.6(C2-)
NetC21_1: C21.1 U6.3(V+)
NetC22_1: C22.1 U6.7(V-)
NetC28_1: C28.1 R21.1 R23.2 U4.5(IN+) U10.3(X)
NetC35_1: C35.1 R24.1 R27.2 U8.5(IN+) U12.3(X)
NetD14_2: D14.2(K) U11.49(VBat)
NetDEL1_1: DEL1.1(K_Red) R31.2
NetDEL1_3: DEL1.3(K_Blue) R30.2
NetDEL1_4: DEL1.4(K_Green) R29.2
NetQ6_2: Q6.2(D) R29.1
NetQ7_2: Q7.2(D) R30.1
NetQ8_2: Q8.2(D) R31.1
NetR13_2: R13.2 ST2.1 U6.16(~{FORCEOFF})
NetR17_2: R17.2 U4.1(OUT) U4.2(IN-)
NetR20_1: R20.1 U9.10(~{SHDN})
NetR22_2: R22.2 U4.6(IN-) U4.7(OUT)
NetR25_1: R25.1 R28.2 U8.3(IN+)
NetR26_2: R26.2 U8.6(IN-) U8.7(OUT)
NetR33_1: R33.1 R37.2 R41.2
NetR34_1: R34.1 R38.2 R42.2
NetR35_1: R35.1 R39.2 R43.2
NetR36_1: R36.1 R40.2 R44.2
NetR46_1: R46.1 R50.1 R54.1
NetR47_1: R47.1 R51.2 R55.2
NetR48_1: R48.1 R52.2 R56.2
NetR49_1: R49.1 R53.2 R57.2
NetST1_2: ST1.2 U6.10(~{INVALID})
NetU8_1: U8.1(OUT) U8.2(IN-)

Not connected (* = marked no-connect by the designer): J4 1* 4* 6* 7* 8* 9*; U3 1(DNC) 5(DNC) 7(DNC) 8(DNC); U5 1(TP)* 5(TP)* 7(NC)* 8(NC)*; U6 1(READY)*; U9 16(BUSY)*; U11 50(3.3V)* 52(Program)* 53(Reset)* 54(5V)* 55(DM)* 56(DP)* 57(GND)* 58(GND)* 59(VUSB)* 60(AREF)* 61(A10)* 62(A11)*

### Notes on the sheet
- R24 et R27 non cablés car la conversion pour la lecture des tensions se fait en amont.
- (near C31) Optionnel
- MicroDial_Data_Log_V2 22/01/21
- Propriété de l'INSU - Toute utilisation ou reproduction est interdire sans l'accord de la DT INSU
- Titre:
- Format:
- Date:
- Déssiné par :
- A3
- Numero:
- Heure:
- Revision:
- Page
- of
- Chemin:
- (in symbol MAX3227EEUE+) T1; R1
- (in symbol OPA2344, part A) A
- (in symbol OPA2344, part B) B

### Library data of the parts
B1 = Battery_CR2450_77: Coin CELL; Value: KEYSTONE 1025-7 + CR2477 ou 2450; Code Commande: F165-0668 + F521-9632
C5 C7 C10-C16 C20-C23 C25 C26 C29 C30 C32 C33 = Cap: as C36 on sheet MicroDial_Data_Log_V2_Part4
C6 C8 C9 C17 C24 = Cap Tantale Pol: Polarized Capacitor Tantale Condensateur Tantale KEMET, 1μF, ±10%, 35 V,ESR 2Ω, CMS boitier B, série T494; Code Commande: RS538-2773 ou RS147-493
C18 C27 C34 = Cap: C0805C221K5RACTU - Condensateur céramique multicouche CMS, 0805 [2012 Metric], 220 pF, 50 V, ± 10%, X7R, Série C; Code Commande: F141-4680
C19 C28 C35 = Cap: 06035C103JAT2A - Condensateur céramique multicouche CMS, 0603 [1608 Metric], 0.01 µF, 50 V, ± 5%, X7R; Code Commande: F183-3871
C31 = Cap Tantale Pol: Polarized Capacitor Tantale TPSB475K035R0700 - Condensateur tantale CMS B, 4.7 µF, 35 V, Série TPS, ± 10%, 1210 [3225 Metric]; Code Commande: F165-8970
D6-D13 = BAT54S_News: Schottky Barrier Double Diode; Code Commande: F980-1510; Value: BAT54S
D14 = Diode: 1N4148 Diode signaux faibles, 100 V, 200 mA, 1 V, 4 ns, 4 A; Code Commande: F108-1177; Value: 1N4148
DEL1 = Kingbright WP154A4SEJ3VBDZGW/CA: Kingbright WP154A4SEJ3VBDZGW/CA T-1 3/4 (5mm) Full Color LED Lamp RGB; Code Commande: Mouser 604-WP154A43VBDZGWCA; Value: Kingbright WP154A4SEJ3VBDZGW/CA
J4 = CONEC 164A11519X: CI D-SUB9 FEMELLE 90°; Code Commande: Mouser 706-164A11519X /  DIGIKEY 164A11519X-ND; Value: CONEC 164A11519X
J5 = Molex 90130-3216: Molex 90130-3216 CGRID3 Double Rangée Coudé 16V; Code Commande: F973-4040; Value: Molex 90130-3216
J6-J9 = Molex 90136-2202: Molex 90136-2202 CGRID3 Simple Rangée Coudé 2V; Code Commande: RS 670-5376; Value: Molex 90136-2202
J10-J12 = PHOENIX CONTACT MKDS 1/4-3.81: PHOENIX CONTACT MKDS 1/4-3.81  SR 10V DROIT; Value: PHOENIX CONTACT MKDS 1/ 4-3,81 - 1727036; Code Commande: F370-4592
JP5 = Jump 12: as JP6 on sheet MicroDial_Data_Log_V2_Part4
PT1-PT6 = PT_1: Code Commande: F385-1564; Value: W HUGHES 300-3001
Q6-Q8 = ZXMN6A07FTA: as Q3 on sheet MicroDial_Data_Log_V2_Part2; Value: ZXMN6A07FTA
R13 R19 R25 R28 = Res: CRGP0603F100K Résistance à puce CMS, 100 kohm, ± 1%, 250 mW, 0603 [1608 Metric], Couche épaisse; Code Commande: F286-1058
R14 R15 ST1 ST2 = Res: MC0603WG00000T5E-TR -  Résistance à puce CMS, 0 ohm, 63 mW, 0603 [1608 Metric], Couche épaisse, Usage Général; Code Commande: F169-2453
R16 R21 R33 R34 R46 R47 = Res: MMA02040E1003BB100 - Résistance CMS MELF, 100 kohm, 200 V, 250 mW, ± 0.1%, Série MMA 0204, Couche métallique; Code Commande: F308-6422
R17 R22 R26 = Res: ERJPA3F4700V -  Résistance à puce CMS, Couche épaisse, 0603 [1608 Metric], 470 ohm, Série ERJPA3, 150 V; Code Commande: F233-5919
R18 R23 = Res: MMA0204MC6803FB300 -  Surface Mount MELF Resistor, 680 kohm, VISHAY - MMA 0204 HV Series, 500 V, Thin Film, 250 mW, ± 1%± 50ppm/K; Code Commande: F247-1794
R20 R32 R45 R58 = Res: as R1 on sheet MicroDial_Data_Log_V2_Part2
R24 = Res: MMA02040E1003BB100 - Résistance CMS MELF, 100 kohm, 200 V, 250 mW, ± 0.1%, Série MMA 0204, Couche métallique; Code Commande: F308-6422 = NC
R27 = Res: MMA0204MC6803FB300 -  Surface Mount MELF Resistor, 680 kohm, VISHAY - MMA 0204 HV Series, 500 V, Thin Film, 250 mW, ± 1%± 50ppm/K; Code Commande: F247-1794 = NC
R29 R30 = Res: ERJPA3F1690V Résistance à puce CMS, Anti-surtensions, 169 ohm, ± 1%, 250 mW, 0603 [1608 Metric], Couche épaisse; Code Commande: F256-1819
R31 = Res: ERJPA3F2800V Résistance à puce CMS, Anti-surtensions, 280 ohm, ± 1%, 250 mW, 0603 [1608 Metric], Couche épaisse; Code Commande: F256-1932
R35 R36 R48 = Res: MMA02040E3902BB100 -  Résistance CMS MELF, 39 kohm, Série MMA 0204, 200 V, Couche métallique, 250 mW, ± 0.1%; Code Commande: F308-6320
R37-R40 R50-R53 = Res: ASC0603-1K0FT5 -  Résistance à puce CMS, Couche épaisse, 1 kohm, ± 1%, 100 mW, 0603 [1608 Metric], Couche épaisse; Code Commande: F207-8907
R41-R44 R54-R57 = Res: MMA02040E1002BB100 - Résistance CMS MELF, 10 kohm, 200 V, 250 mW, ± 0.1%, Série MMA 0204, Couche métallique; Code Commande: F308-6185
R49 = Res: MMA02040C2002FB300 Résistance CMS MELF, 20 kohm, MMA 0204 Series, 200 V, Couche mince, 250 mW, ± 1%; Code Commande: F261-4478
U3 = LT6657: LT6657AHMS8-2.5#PBF Référence de tension Series, AEC-Q100, Référence 2.5V, 1.5ppm/°C, MSOP-8; Code Commande: Digikey LT6657AHMS8-2.5#PBF-ND; Value: LT6657AHMS8-2.5#PBF-ND
U4 U8 = OPA2344: OPA2344UA Amplificateur opérationnel, 2 amplificateurs, 1 MHz, 0.8 V/µs, 2.5V à 5.5V, SOIC, 8 Broche(s); Code Commande: F311-7453; Value: OPA2344UA
U5 = REF192: Precision Micropower, Low Dropout  Voltage References; Code Commande: F960-5207; Value: REF192GSZ
U6 = MAX3227EEUE+: MAX3227EEUE+ -  Transceiver, RS232, Alimentation 3V-5.5V, 1 Driver, TSSOP-16; Code Commande: F251-1501; Value: MAX3227EEUE+
U7 U10 U12 = MAX4781EUE+: MULTIPLEXEUR ANALOG SIMPLE 8:1; Code Commande: F251-3726; Value: MAX4781EUE+
U9 = ADS8344E: 16-Bit, 8-Channel Serial Output Sampling  ANALOG-TO-DIGITAL CONVERTER; Code Commande: F300-4391; Value: ADS8344E
U11 = Teensy_3.6: 32Bit Arduino Compatible Microcontrolleur; Code Commande: Digikey 1568-1465-ND / Mouser 474-DEV-14058; Value: Teensy_3.6

## Nets that join several sheets
+3.3V: MicroDial_Data_Log_V2_Part4 (11 pins), MicroDial_Data_Log_V2_Part3 (F1.2), MicroDial_Data_Log_V2 (29 pins)
+3.3V_T: MicroDial_Data_Log_V2_Part3 (F1.1 JP2.1), MicroDial_Data_Log_V2 (5 pins)
+5V: MicroDial_Data_Log_V2_Part4 (10 pins), MicroDial_Data_Log_V2_Part2 (8 pins), MicroDial_Data_Log_V2_Part3 (F2.2), MicroDial_Data_Log_V2 (9 pins)
+VIN_T: MicroDial_Data_Log_V2_Part3 (JP1.1), MicroDial_Data_Log_V2 (C26.1 U11.48)
DIP2_1: MicroDial_Data_Log_V2_Part4 (30 pins), MicroDial_Data_Log_V2_Part2 (10 pins), MicroDial_Data_Log_V2_Part3 (7 pins), MicroDial_Data_Log_V2 (103 pins)
17/A3/PWM/SDA0/Touch: MicroDial_Data_Log_V2_Part4 (R79.1 R80.2), MicroDial_Data_Log_V2 (U11.39)
/CS1_WIZ820io: MicroDial_Data_Log_V2_Part4 (ET1.J1-5 R75.1), MicroDial_Data_Log_V2 (U11.23)
/CS_CLICK: MicroDial_Data_Log_V2_Part4 (MKB_SK1.3 R62.1), MicroDial_Data_Log_V2 (U11.11)
/INT_WIZ: MicroDial_Data_Log_V2_Part4 (ET1.J1-6), MicroDial_Data_Log_V2 (U11.28)
/RESET_WIZ: MicroDial_Data_Log_V2_Part4 (ET1.J2-5 R78.1), MicroDial_Data_Log_V2 (U11.31)
A0_CLICK: MicroDial_Data_Log_V2_Part4 (MKB_SK1.1), MicroDial_Data_Log_V2 (U11.36)
CAN0RX_MCP: MicroDial_Data_Log_V2_Part4 (U15.4), MicroDial_Data_Log_V2 (U11.6)
CAN0TX_MCP: MicroDial_Data_Log_V2_Part4 (U15.1), MicroDial_Data_Log_V2 (U11.5)
CMD_RELAIS_1: MicroDial_Data_Log_V2_Part2 (Q3.1 R9.2), MicroDial_Data_Log_V2 (U11.38)
CMD_RESET_RELAIS_2: MicroDial_Data_Log_V2_Part2 (R7.2), MicroDial_Data_Log_V2 (U11.7)
CMD_SET_RELAIS_2: MicroDial_Data_Log_V2_Part2 (R8.2), MicroDial_Data_Log_V2 (U11.8)
DAC0: MicroDial_Data_Log_V2_Part4 (R65.2 U13.3), MicroDial_Data_Log_V2 (U11.32)
DAC1: MicroDial_Data_Log_V2_Part4 (R66.2 U14.3), MicroDial_Data_Log_V2 (U11.33)
GPIO0_SMA: MicroDial_Data_Log_V2_Part4 (R70.2 U1.3), MicroDial_Data_Log_V2 (U11.16)
GPIO1_SMA: MicroDial_Data_Log_V2_Part4 (R73.2 U1.5), MicroDial_Data_Log_V2 (U11.17)
INT_CLICK: MicroDial_Data_Log_V2_Part4 (MKB_SK1.15), MicroDial_Data_Log_V2 (U11.20)
IO_INTERLOCK_LASER: MicroDial_Data_Log_V2_Part4 (R76.1 R77.1), MicroDial_Data_Log_V2 (U11.37)
PWDN_WIZ: MicroDial_Data_Log_V2_Part4 (ET1.J2-4 R74.1), MicroDial_Data_Log_V2 (U11.18)
PWM_CLICK: MicroDial_Data_Log_V2_Part4 (MKB_SK1.16), MicroDial_Data_Log_V2 (U11.4)
RESET_CLICK: MicroDial_Data_Log_V2_Part4 (MKB_SK1.2 R61.1), MicroDial_Data_Log_V2 (U11.19)
RX_CLICK: MicroDial_Data_Log_V2_Part4 (MKB_SK1.14), MicroDial_Data_Log_V2 (U11.9)
SCL1_CLICK: MicroDial_Data_Log_V2_Part4 (MKB_SK1.12), MicroDial_Data_Log_V2 (U11.29)
SDA1_CLICK: MicroDial_Data_Log_V2_Part4 (MKB_SK1.11), MicroDial_Data_Log_V2 (U11.30)
SPI_MISO0: MicroDial_Data_Log_V2_Part4 (MKB_SK1.5), MicroDial_Data_Log_V2 (U9.15 U11.14)
SPI_MISO1_WIZ: MicroDial_Data_Log_V2_Part4 (ET1.J2-6), MicroDial_Data_Log_V2 (U11.3)
SPI_MOSI0: MicroDial_Data_Log_V2_Part4 (MKB_SK1.6), MicroDial_Data_Log_V2 (U9.17 U11.13)
SPI_MOSI1_WIZ: MicroDial_Data_Log_V2_Part4 (ET1.J1-3), MicroDial_Data_Log_V2 (U11.2)
SPI_SCK0: MicroDial_Data_Log_V2_Part4 (MKB_SK1.4), MicroDial_Data_Log_V2 (U9.19 U11.35)
SPI_SCK1_WIZ: MicroDial_Data_Log_V2_Part4 (ET1.J1-4), MicroDial_Data_Log_V2 (U11.24)
TX_CLICK: MicroDial_Data_Log_V2_Part4 (MKB_SK1.13), MicroDial_Data_Log_V2 (U11.10)